# Altium schematic sheet PWR ICs.SchDoc: RK3399 SOM Module
size A3; Date: 23.05.2023; Author: Łukasz Nowarkiewicz; SheetNumber: 16; SheetTotal: 21; RegistrationBookNumber: 144201; title_sheet: Power Converters ICs
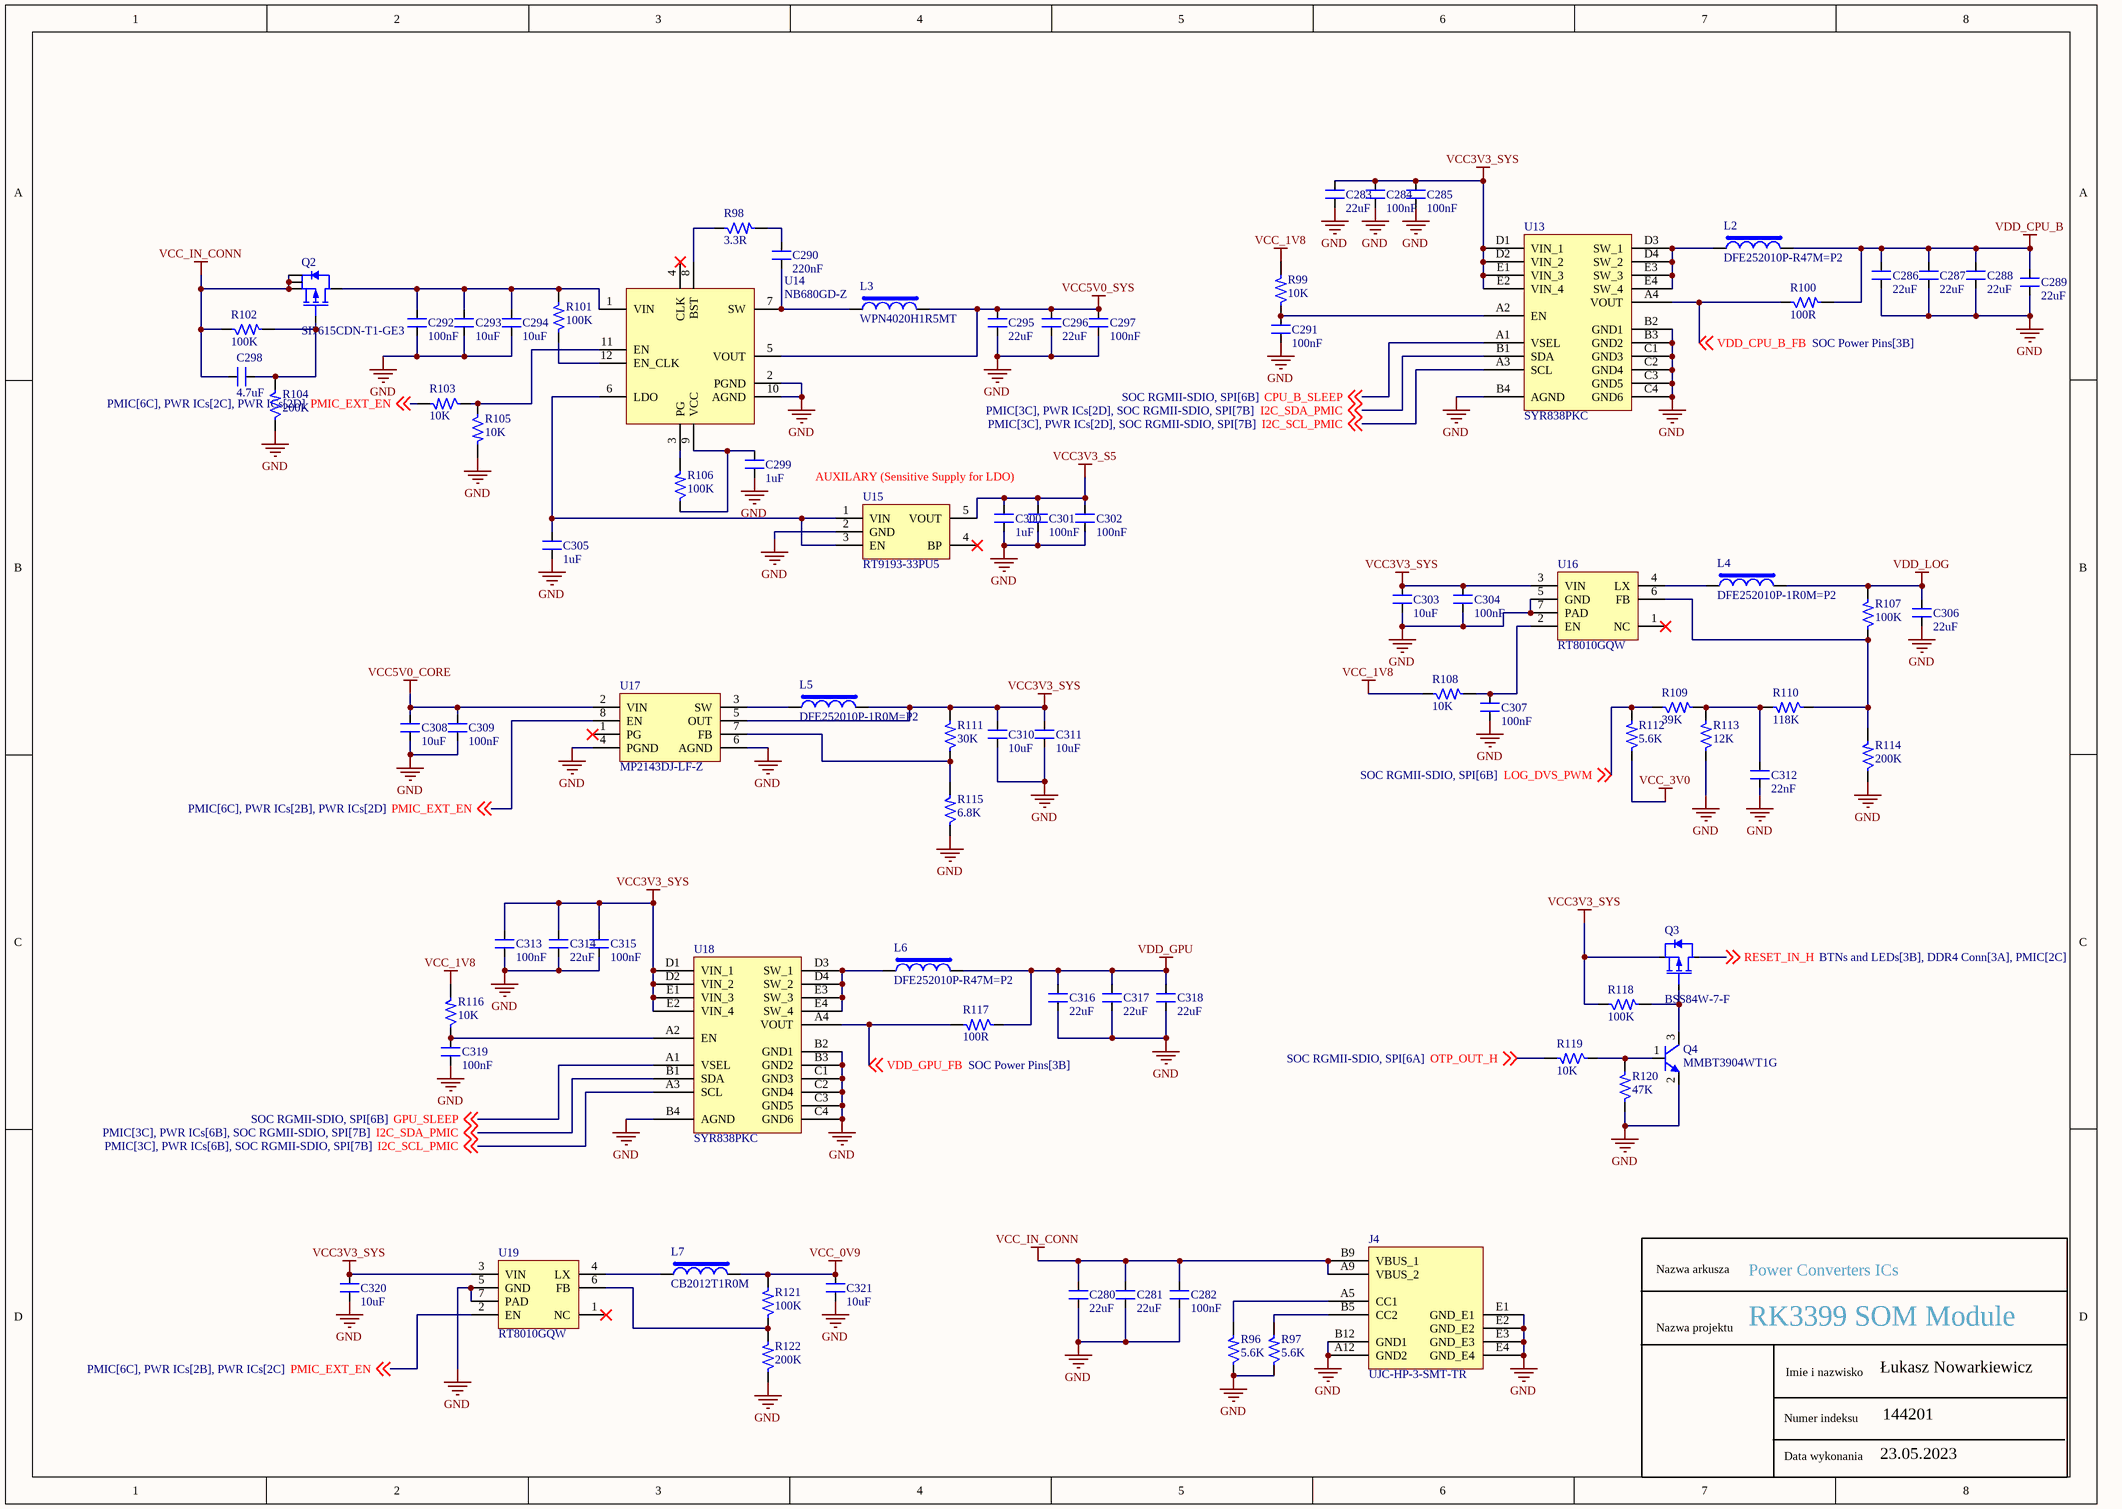
[diagram p0: PWR ICs.SchDoc]

## Parts
C280  22uF  [CAP_0603]
C281  22uF  [CAP_0603]
C282  100nF  [CAP_0402]
C283  22uF  [CAP_0603]
C284  100nF  [CAP_0402]
C285  100nF  [CAP_0402]
C286  22uF  [CAP_0603]
C287  22uF  [CAP_0603]
C288  22uF  [CAP_0603]
C289  22uF  [CAP_0603]
C290  220nF  [CAP_0402]
C291  100nF  [CAP_0402]
C292  100nF  [CAP_0402]
C293  10uF  [CAP_0402]
C294  10uF  [CAP_0402]
C295  22uF  [CAP_0603]
C296  22uF  [CAP_0603]
C297  100nF  [CAP_0402]
C298  4.7uF  [CAP_0402]
C299  1uF  [CAP_0402]
C300  1uF  [CAP_0402]
C301  100nF  [CAP_0402]
C302  100nF  [CAP_0402]
C303  10uF  [CAP_0402]
C304  100nF  [CAP_0402]
C305  1uF  [CAP_0402]
C306  22uF  [CAP_0603]
C307  100nF  [CAP_0402]
C308  10uF  [CAP_0402]
C309  100nF  [CAP_0402]
C310  10uF  [CAP_0402]
C311  10uF  [CAP_0402]
C312  22nF  [CAP_0402]
C313  100nF  [CAP_0402]
C314  22uF  [CAP_0603]
C315  100nF  [CAP_0402]
C316  22uF  [CAP_0603]
C317  22uF  [CAP_0603]
C318  22uF  [CAP_0603]
C319  100nF  [CAP_0402]
C320  10uF  [CAP_0402]
C321  10uF  [CAP_0402]
J4  UJC-HP-3-SMT-TR  [CON6_48.4_UJC-HP-3-SMT-TR]
L2  DFE252010P-R47M=P2  [IND_1008]
L3  WPN4020H1R5MT  [IND_1616]
L4  DFE252010P-1R0M=P2  [IND_1008]
L5  DFE252010P-1R0M=P2  [IND_1008]
L6  DFE252010P-R47M=P2  [IND_1008]
L7  CB2012T1R0M  [IND_0805]
Q2  SI7615CDN-T1-GE3  [PowerPAK_1212-8_SMD]
Q3  BSS84W-7-F  [SOT-323-3]
Q4  MMBT3904WT1G  [SOT-323-3]
R96  5.6K  [RES_0402]
R97  5.6K  [RES_0402]
R98  3.3R  [RES_0402]
R99  10K  [RES_0402]
R100  100R  [RES_0402]
R101  100K  [RES_0402]
R102  100K  [RES_0402]
R103  10K  [RES_0402]
R104  200K  [RES_0402]
R105  10K  [RES_0402]
R106  100K  [RES_0402]
R107  100K  [RES_0402]
R108  10K  [RES_0402]
R109  39K  [RES_0402]
R110  118K  [RES_0402]
R111  30K  [RES_0402]
R112  5.6K  [RES_0402]
R113  12K  [RES_0402]
R114  200K  [RES_0402]
R115  6.8K  [RES_0402]
R116  10K  [RES_0402]
R117  100R  [RES_0402]
R118  100K  [RES_0402]
R119  10K  [RES_0402]
R120  47K  [RES_0402]
R121  100K  [RES_0402]
R122  200K  [RES_0402]
U13  SYR838PKC  [CSP20_15.7_100x84_SMD]
U14  NB680GD-Z  [QFN-12_19_118X118_SMD]
U15  RT9193-33PU5  [SC70-5]
U16  RT8010GQW  [WDFN-6_26_133X100_SMD]
U17  MP2143DJ-LF-Z  [SOT23-8]
U18  SYR838PKC  [CSP20_15.7_100x84_SMD]
U19  RT8010GQW  [WDFN-6_26_133X100_SMD]

## Nets
GND: C280.1 C281.1 C282.1 C283.1 C284.1 C285.1 C286.1 C287.1 C288.1 C289.1 C291.1 C292.1 C293.1 C294.1 C295.1 C296.1 C297.1 C299.1 C300.1 C301.1 C302.1 C303.1 C304.1 C305.1 C306.1 C307.1 C308.1 C309.1 C310.1 C311.1 C312.1 C313.1 C314.1 C315.1 C316.1 C317.1 C318.1 C319.1 C320.1 C321.1 J4.A12(GND2) J4.B12(GND1) J4.E1(GND_E1) J4.E2(GND_E2) J4.E3(GND_E3) J4.E4(GND_E4) Q4.2(E) R96.1 R97.1 R104.1 R105.2 R113.1 R114.1 R115.1 R120.1 R122.1 U13.B2(GND1) U13.B3(GND2) U13.B4(AGND) U13.C1(GND3) U13.C2(GND4) U13.C3(GND5) U13.C4(GND6) U14.2(PGND) U14.10(AGND) U15.2(GND) U16.5(GND) U16.7(PAD) U17.4(PGND) U17.6(AGND) U18.B2(GND1) U18.B3(GND2) U18.B4(AGND) U18.C1(GND3) U18.C2(GND4) U18.C3(GND5) U18.C4(GND6) U19.5(GND) U19.7(PAD)
VCC3V3_S5: C300.2 C301.2 C302.2 U15.5(VOUT)
VCC3V3_SYS: C283.2 C284.2 C285.2 C303.2 C304.2 C310.2 C311.2 C313.2 C314.2 C315.2 C320.2 L5.2 Q3.2(S) R111.2 R118.1 U13.D1(VIN_1) U13.D2(VIN_2) U13.E1(VIN_3) U13.E2(VIN_4) U16.3(VIN) U17.5(OUT) U18.D1(VIN_1) U18.D2(VIN_2) U18.E1(VIN_3) U18.E2(VIN_4) U19.3(VIN)
VCC5V0_CORE: C308.2 C309.2 U17.2(VIN)
VCC5V0_SYS: C295.2 C296.2 C297.2 L3.2 U14.5(VOUT)
VCC_0V9: C321.2 L7.2 R121.2
VCC_1V8: R99.2 R108.1 R116.2
VCC_3V0: R112.1
VCC_IN_CONN: C280.2 C281.2 C282.2 C298.1 J4.A9(VBUS_2) J4.B9(VBUS_1) Q2.1(S) Q2.2(S) Q2.3(S) R102.1
VDD_CPU_B: C286.2 C287.2 C288.2 C289.2 L2.2 R100.2
VDD_GPU: C316.2 C317.2 C318.2 L6.2 R117.1
VDD_LOG: C306.2 L4.2 R107.2
CPU_B_SLEEP: U13.A1(VSEL) ; off-sheet CPU_B_SLEEP
GPU_SLEEP: U18.A1(VSEL) ; off-sheet GPU_SLEEP
I2C_SCL_PMIC: U13.A3(SCL) U18.A3(SCL) ; off-sheet I2C_SCL_PMIC
I2C_SDA_PMIC: U13.B1(SDA) U18.B1(SDA) ; off-sheet I2C_SDA_PMIC
LOG_DVS_PWM: R109.1 R112.2 ; off-sheet LOG_DVS_PWM
OTP_OUT_H: R119.2 ; off-sheet OTP_OUT_H
PMIC_EXT_EN: R103.2 U17.8(EN) U19.2(EN) ; off-sheet PMIC_EXT_EN
RESET_IN_H: Q3.3(D) ; off-sheet RESET_IN_H
VDD_CPU_B_FB: R100.1 U13.A4(VOUT) ; off-sheet VDD_CPU_B_FB
VDD_GPU_FB: R117.2 U18.A4(VOUT) ; off-sheet VDD_GPU_FB
NetC290_1: C290.1 L3.1 U14.7(SW)
NetC290_2: C290.2 R98.2
NetC291_2: C291.2 R99.1 U13.A2(EN)
NetC292_2: C292.2 C293.2 C294.2 Q2.5(D) R101.2 U14.1(VIN)
NetC298_2: C298.2 Q2.4(G) R102.2 R104.2
NetC299_2: C299.2 R106.1 U14.9(VCC)
NetC305_2: C305.2 U14.6(LDO) U15.1(VIN) U15.3(EN)
NetC307_2: C307.2 R108.2 U16.2(EN)
NetC312_2: C312.2 R109.2 R110.2 R113.2
NetC319_2: C319.2 R116.1 U18.A2(EN)
NetJ4_A5: J4.A5(CC1) R96.2
NetJ4_B5: J4.B5(CC2) R97.2
NetL2_1: L2.1 U13.D3(SW_1) U13.D4(SW_2) U13.E3(SW_3) U13.E4(SW_4)
NetL4_1: L4.1 U16.4(LX)
NetL5_1: L5.1 U17.3(SW)
NetL6_1: L6.1 U18.D3(SW_1) U18.D4(SW_2) U18.E3(SW_3) U18.E4(SW_4)
NetL7_1: L7.1 U19.4(LX)
NetQ3_1: Q3.1(G) Q4.3(C) R118.2
NetQ4_1: Q4.1(B) R119.1 R120.2
NetR98_1: R98.1 U14.8(BST)
NetR101_1: R101.1 U14.12(EN_CLK)
NetR103_1: R103.1 R105.1 U14.11(EN)
NetR106_2: R106.2 U14.3(PG)
NetR107_1: R107.1 R110.1 R114.2 U16.6(FB)
NetR111_1: R111.1 R115.2 U17.7(FB)
NetR121_1: R121.1 R122.2 U19.6(FB)

Not connected (* = marked no-connect by the designer): U14 4(CLK)*; U15 4(BP)*; U16 1(NC)*; U17 1(PG)*; U19 1(NC)*

## Notes on the sheet
- AUXILARY (Sensitive Supply for LDO)
- Nazwa arkusza
- Nazwa projektu
- Imie i nazwisko
- Data wykonania
- Numer indeksu

## Library data of the parts
C280 C281 C283 C286-C289 C295 C296 C306 C314 C316-C318 = CAP_22uF-10V-20%-0603: 22µF ±20% 10V Ceramic Capacitor X5R 0603 (1608 Metric); Manufacturer: Murata Electronics; Manufacturer Part Number: GRM188R61A226ME15D; Case/Package: 0603; Supplier-1: Digikey
C282 C284 C285 C291 C292 C297 C301 C302 C304 C307 C309 C313 C315 C319 = CAP_100nF-25V-10%-0402: 0.1µF ±10% 25V Ceramic Capacitor X7R 0402 (1005 Metric); Manufacturer: Walsin Technology Corporation; Manufacturer Part Number: 0402B104K250CT; Case/Package: 0402; Supplier-1: Digikey
C290 = CAP_220nF-10V-10%-0402: 0.22µF ±10% 10V Ceramic Capacitor X7R 0402 (1005 Metric); Manufacturer: Samsung Electro-Mechanics; Manufacturer Part Number: CL05B224KP5NNNC; Case/Package: 0402; Supplier-1: Digikey
C293 C294 C303 C308 C310 C311 C320 C321 = CAP_10uF-10V-20%-0402: 10µF ±20% 10V Ceramic Capacitor X5R 0402 (1005 Metric); Manufacturer Part Number: CL05A106MP5NUNC; Manufacturer: Samsung Electro-Mechanics; Case/Package: 0402; Supplier-1: Digikey
C298 = CAP_4.7uF-10V-10%-0402: 4.7µF ±10% 10V Ceramic Capacitor X5R 0402 (1005 Metric); Manufacturer: Samsung Electro-Mechanics; Manufacturer Part Number: CL05A475KP5NRNC; Case/Package: 0402; Supplier-1: Digikey
C299 C300 C305 = CAP_1uF-16V-10%-0402: 1µF ±10% 16V Ceramic Capacitor X5R 0402 (1005 Metric); Manufacturer: Knowles Novacap; Manufacturer Part Number: 0402BW105K160YT; Case/Package: 0402; Supplier-1: Digikey
C312 = CAP_22nF-10V-10%-0402: 0.022µF ±10% 10V Ceramic Capacitor X7R 0402 (1005 Metric); Manufacturer: Samsung Electro-Mechanics; Manufacturer Part Number: CL05B223KP5NNNC; Case/Package: 0402; Supplier-1: Digikey
J4 = CON-TYPEC_6X1-100-RA-TH: USB Connectors USB jack, C type, power only, 6 pin, horizonal, gold flash plating, surface mount, T&R; Manufacturer: CUI Devices; Manufacturer Part Number: UJC-HP-3-SMT-TR; Case/Package: TH; Supplier-1: Mouser
L2 L6 = IND_470nH-5A-20%-1008: 470nH Shielded Wirewound Inductor 5A 35mOhm Max 1008 (2520 Metric); Manufacturer: Murata Electronics; Manufacturer Part Number: DFE252010P-R47M=P2; Case/Package: 1008; Supplier-1: Digikey
L3 = IND_1.5uH-6A-20%-SMD: Wire Wound SMD Power Inductors – WPN Series / Operating Temp. : -40℃~+125℃ (Including self-heating); Manufacturer: Sunlord; Mnaufcaturer Part Number: WPN4020H1R5MT; Case/Package: SMD; Supplier-1: NA
L4 L5 = IND_1uH-3.8A-20%-1008: 1µH Shielded Wirewound Inductor 3.8A 54mOhm Max 1008 (2520 Metric); Manufacturer: Murata Electronics; Manufacturer Part Number: DFE252010P-1R0M=P2; Case/Package: 1008; Supplier-1: Digikey
L7 = IND_1uF-0.5A-20%-0805: 1uH ±20% 500mA 150mΩ 0805 Inductors (SMD) RoHS; Manufacturer: Taiyo Yuden; Manufacturer Part Number: CB2012T1R0M; Case/Package: 0805; Supplier-1: LCSC
Q2 = MOSFET-P_20V-35A-1212-8: P-Channel 20V 35A (Tc) 33W (Tc) Surface Mount PowerPAK® 1212-8; Manufacturer: Vishay Siliconix; Manufacturer Part Number: SI7615CDN-T1-GE3; Case/Package: PowerPAK® 1212-8; Supplier-1: Digikey
Q3 = MOSFET-P_50V-130mA-SOT-323: P-Channel 50V 130mA (Ta) 200mW (Ta) Surface Mount SOT-323; Manufacturer: Diodes Incorporated; Manufacturer Part Number: BSS84W-7-F; Case/Package: SOT-323; Supplier-1: Digikey
Q4 = TRNS-NPN_60V-0.2A-SOT323: Bipolar Transistors - BJT 200mA 60V NPN; Manufacturer: ON Semiconductor; Manufacturer Part Number: MMBT3904WT1G; Case/Package: SOT323; Supplier-1: Digikey
R96 R97 R112 = RES_5.6K-0.1W-1%-0402: 5.6 kOhms ±1% 0.1W, 1/10W Chip Resistor 0402 (1005 Metric) Automotive AEC-Q200, Moisture Resistant Thick Film; Manufacturer: KOA Speer Electronics, Inc.; Manufacturer Part Number: RK73H1ETTP5601F; Case/Package: 0402; Supplier-1: Digikey
R98 = RES_3.3R-0.1W-1%-0402: 3.3 Ohms ±1% 0.1W, 1/10W Chip Resistor 0402 (1005 Metric) Anti-Sulfur, Automotive AEC-Q200 Thick Film; Manufacturer: Panasonic Electronic Components; Manufacturer Part Number: ERJ-U02F3R30X; Case/Package: 0402; Supplier-1: Digikey
R99 R103 R105 R108 R116 R119 = RES_10K-0.1W-1%-0402: 10 kOhms ±1% 0.1W, 1/10W Chip Resistor 0402 (1005 Metric) Anti-Sulfur Thin Film; Manufacturer: Vishay Beyschlag/Draloric/BC Components; Manufacturer Part Number: MCS04020C1002FE000; Case/Package: 0402; Supplier-1: Digikey
R100 R117 = RES_100R-0.1W-1%-0402: 100 Ohms ±1% 0.1W, 1/10W Chip Resistor 0402 (1005 Metric) Automotive AEC-Q200, Moisture Resistant Thick Film; Manufacturer: KOA Speer Electronics, Inc.; Manufacturer Part Number: RK73H1ETTP1000F; Case/Package: 0402; Supplier-1: Digikey
R101 R102 R106 R107 R118 R121 = RES_100K-0.1W-1%-0402: 100 kOhms ±1% 0.1W, 1/10W Chip Resistor 0402 (1005 Metric) Anti-Sulfur Thin Film; Manufacturer: Vishay Beyschlag/Draloric/BC Components; Manufacturer Part Number: MCS04020C1003FE000; Case/Package: 0402; Supplier-1: Digikey
R104 R114 R122 = RES_200K-0.1W-1%-0402: 200 kOhms ±1% 0.1W, 1/10W Chip Resistor 0402 (1005 Metric) Automotive AEC-Q200 Thick Film; Manufacturer: Panasonic Electronic Components; Manufacturer Part number: ERJ-2RKF2003X; Case/Package: 0402; Supplier-1: Digikey
R109 = RES_39K-0.1W-1%-0402: 39 kOhms ±1% 0.1W, 1/10W Chip Resistor 0402 (1005 Metric) Automotive AEC-Q200, Moisture Resistant Thick Film; Manufacturer: KOA Speer Electronics, Inc.; Manufacturer Part Number: RK73H1ETTP3902F; Case/Package: 0402; Supplier-1: Digikey
R110 = RES_118K-0.1W-1%-0402: 118 kOhms ±1% 0.1W, 1/10W Chip Resistor 0402 (1005 Metric) Automotive AEC-Q200, Moisture Resistant Thick Film; Manufacturer: KOA Speer Electronics, Inc.; Manuafcturer Part Number: RK73H1ETTP1183F; Case/Package: 0402; Supplier-1: Digikey
R111 = RES_30K-0.1W-1%-0402: 30 kOhms ±1% 0.1W, 1/10W Chip Resistor 0402 (1005 Metric) Automotive AEC-Q200, Moisture Resistant Thick Film; Manufacturer: KOA Speer Electronics, Inc.; Manufacturer Part Number: RK73H1ETTP3002F; Case/Package: 0402; Supplier-1: Digikey
R113 = RES_12K-0.1W-1%-0402: 12 kOhms ±1% 0.1W, 1/10W Chip Resistor 0402 (1005 Metric) Anti-Sulfur Thin Film; Manufacturer: Vishay Beyschlag/Draloric/BC Components; Manufacturer Part Number: MCS04020C1202FE000; Case/Package: 0402; Supplier-1: Digikey
R115 = RES_6.8K-0.1W-1%-0402: 6.8 kOhms ±1% 0.1W, 1/10W Chip Resistor 0402 (1005 Metric) Anti-Sulfur Thin Film; Manufacturer Part Number: MCS04020C6801FE000; Manufacturer: Vishay Beyschlag/Draloric/BC Components; Case/Package: 0402; Supplier-1: Digikey
R120 = RES_47K-0.1W-1%-0402: 47 kOhms ±1% 0.1W, 1/10W Chip Resistor 0402 (1005 Metric) Automotive AEC-Q200 Thick Film; Manufacturer: Panasonic Electronic Components; Manufacturer Part Number: ERJ-2RKF4702X; Case/Package: 0402; Supplier-1: Digikey
U13 U18 = IC_SYR838PKC: Step-Down Positive Programmable 1 6A 2.4MHz CSP1.56*1.96-20 DC-DC Converters RoHS; Manufacturer: Silergy Corp; Manufacturer Part Number: SYR838PKC; Case/Package: CSP1.56*1.96-20; Supplier-1: LCSC
U14 = REG_3.3V-26V-8A-QFN-12: Switching Voltage Regulators 26V Fixed 3.3 V-8A Sync Buck Converter; Manufacturer: Monolithic Power Systems (MPS); Manufacturer Part Number: NB680GD-Z; Case/Package: QFN-12; Supplier-1: Mouser
U15 = REG_3.3V-5.5V-300mA-SC-70-5: SC-70-5 Dropout Regulators(LDO) RoHS; Manufacturer: Richtek Tech; Manufacturer Part Number: RT9193-33PU5; Case/Package: SC-70-5; Supplier-1: LCSC
U16 U19 = REG-ADJ_5.5V-5.5V-1A-6-WDFN: Buck Switching Regulator IC Positive Adjustable 0.6V 1 Output 1A 6-WDFN Exposed Pad; Manufacturer: Richtek USA Inc.; Manufacturer Part Number: RT8010GQW; Case/Package: 6-WDFN; Supplier-1: Digikey
U17 = REG_0.6~5V-5.5V-3A-TSOT-23-8: Switching Voltage Regulators 3A, 5.5V, 1.2MHz Sync Stp-Dwn Swtchr; Manufacturer: Monolithic Power Systems (MPS); Manufacturer Part Number: MP2143DJ-LF-Z; Case/Package: TSOT-23-8; Supplier-1: Mouser